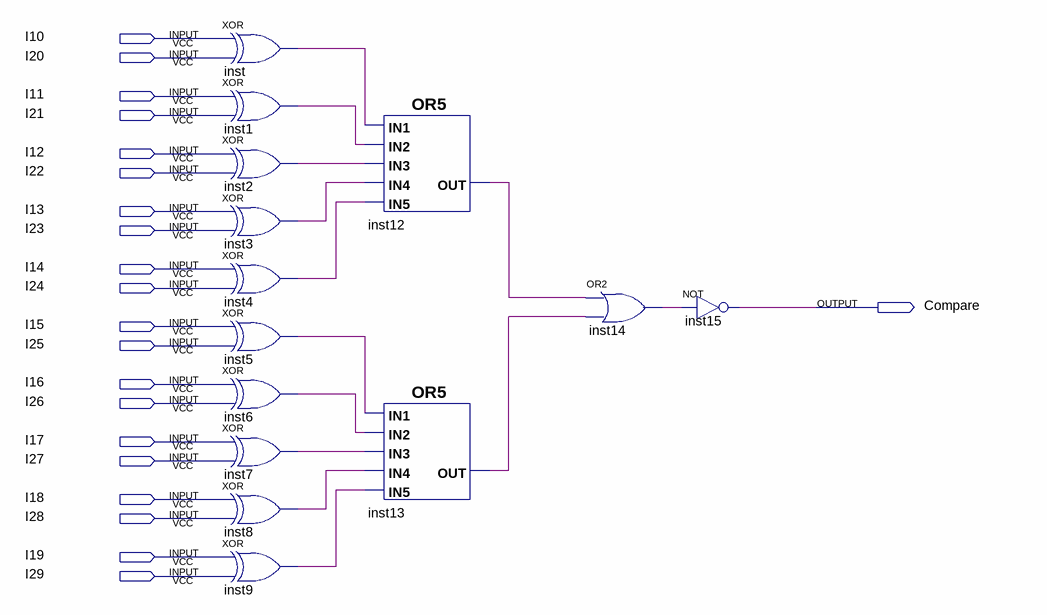
[diagram p0: schematic sheet]
// Quartus schematic Compare10bit.bdf as structural Verilog: 14 symbols, 21 pins
module Compare10bit (
  input  I10,
  input  I20,
  input  I11,
  input  I21,
  input  I12,
  input  I22,
  input  I13,
  input  I23,
  input  I14,
  input  I24,
  input  I15,
  input  I25,
  input  I16,
  input  I26,
  input  I17,
  input  I27,
  input  I18,
  input  I28,
  input  I19,
  input  I29,
  output Compare
);

  wire inst1_out, inst2_out, inst3_out, inst4_out, inst5_out, inst6_out, inst7_out, inst8_out, inst9_out,
       inst12_out, inst13_out, inst14_out, inst_out;

  xor inst (inst_out, I10, I20);
  xor inst1 (inst1_out, I11, I21);
  xor inst2 (inst2_out, I12, I22);
  xor inst3 (inst3_out, I13, I23);
  xor inst4 (inst4_out, I14, I24);
  xor inst5 (inst5_out, I15, I25);
  xor inst6 (inst6_out, I16, I26);
  xor inst7 (inst7_out, I17, I27);
  xor inst8 (inst8_out, I18, I28);
  xor inst9 (inst9_out, I19, I29);
  or inst12 (inst12_out, inst_out, inst1_out, inst2_out, inst3_out, inst4_out);
  or inst13 (inst13_out, inst5_out, inst6_out, inst7_out, inst8_out, inst9_out);
  or inst14 (inst14_out, inst12_out, inst13_out);
  not inst15 (Compare, inst14_out);
endmodule
